# Altium schematic sheet Connectors.SchDoc
size A4
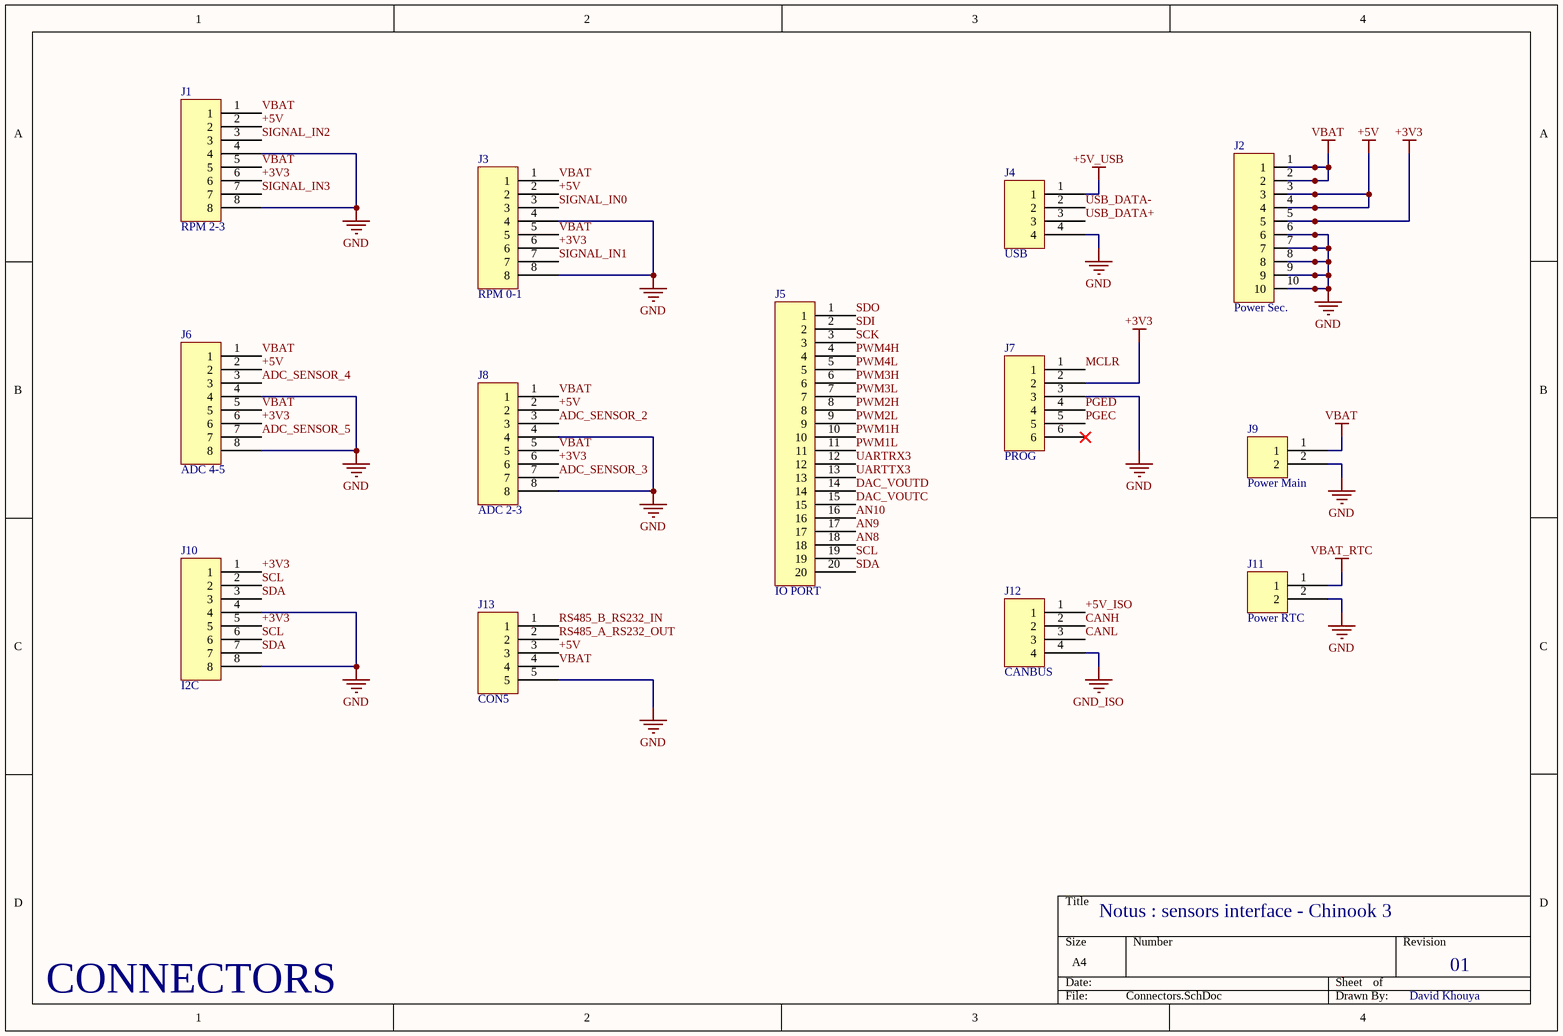
[diagram p0: Connectors.SchDoc]

## Parts
J1  RPM 2-3  [1633600000]
J2  Power Sec.  [104652-1]
J3  RPM 0-1  [1633600000]
J4  USB  [AU-Y1007-R]
J5  IO PORT  [104652-2]
J6  ADC 4-5  [1633600000]
J7  PROG  [A31411-ND]
J8  ADC 2-3  [1633600000]
J9  Power Main  [XT60_CON]
J10  I2C  [1633600000]
J11  Power RTC  [BS-1225-PC]
J12  CANBUS  [CON4_100MILS]
J13  CON5  [1607070000]

## Nets
+3V3: J1.6 J2.5 J3.6 J6.6 J7.2 J8.6 J10.1 J10.5
+5V: J1.2 J2.3 J2.4 J3.2 J6.2 J8.2 J13.3
+5V_USB: J4.1
GND: J1.4 J1.8 J2.6 J2.7 J2.8 J2.9 J2.10 J3.4 J3.8 J4.4 J6.4 J6.8 J7.3 J8.4 J8.8 J9.2 J10.4 J10.8 J11.2 J13.5
GND_ISO: J12.4
VBAT: J1.1 J1.5 J2.1 J2.2 J3.1 J3.5 J6.1 J6.5 J8.1 J8.5 J9.1 J13.4
VBAT_RTC: J11.1
+5V_ISO: J12.1
ADC_SENSOR_2: J8.3
ADC_SENSOR_3: J8.7
ADC_SENSOR_4: J6.3
ADC_SENSOR_5: J6.7
AN8: J5.18
AN9: J5.17
AN10: J5.16
CANH: J12.2
CANL: J12.3
DAC_VOUTC: J5.15
DAC_VOUTD: J5.14
MCLR: J7.1
PGEC: J7.5
PGED: J7.4
PWM1H: J5.10
PWM1L: J5.11
PWM2H: J5.8
PWM2L: J5.9
PWM3H: J5.6
PWM3L: J5.7
PWM4H: J5.4
PWM4L: J5.5
RS485_A_RS232_OUT: J13.2
RS485_B_RS232_IN: J13.1
SCK: J5.3
SCL: J5.19 J10.2 J10.6
SDA: J5.20 J10.3 J10.7
SDI: J5.2
SDO: J5.1
SIGNAL_IN0: J3.3
SIGNAL_IN1: J3.7
SIGNAL_IN2: J1.3
SIGNAL_IN3: J1.7
UARTRX3: J5.12
UARTTX3: J5.13
USB_DATA+: J4.3
USB_DATA-: J4.2

Not connected (* = marked no-connect by the designer): J7 6*

## Notes on the sheet
- Notus : sensors interface - Chinook 3
- 01
- CONNECTORS
- David Khouya

## Library data of the parts
J1 J3 J6 J8 J10 = CON8: 8 pins connector
J2 = CON10: 10 pins connector
J4 J12 = CON4: 4 pins connector
J5 = CON20: 20 pins connector
J7 = CON6: 6 pins connectors
J9 J11 = CON2: 2 pins connector
J13 = CON5: 5 pins connector